# Altium schematic sheet twentyfour.SchDoc
size Letter
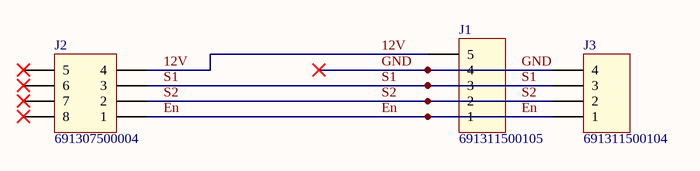
[diagram p0: twentyfour.SchDoc]

## Parts
J1  691311500105  [691311500105]
J2  691307500004  [691307500004]
J3  691311500104  [691311500104]

## Nets
12V: J1.5 J2.4
En: J1.1 J2.1 J3.1
GND: J1.4 J3.4
S1: J1.3 J2.3 J3.3
S2: J1.2 J2.2 J3.2

Not connected (* = marked no-connect by the designer): J2 5* 6* 7* 8*

## Library data of the parts
J1 = 691311500105: WR-TBL Serie 311 - 5.08 mm Close Vertical PCB Header, 05p; Pitch: 5.08 mm; ComponentLink1Description: Manufacturer; ComponentLink1URL: http://www.we-online.de; ComponentLink2Description: Datasheet; ComponentLink2URL: http://katalog.we-online.de/em/datasheet/6913115001xx.pdf; Part Number: 691311500105; Published Date: Feb. 2017; Publisher: Wurth Elektronik; Pin Number: 05p
J2 = 691307500004: WR-TBL Serie 3075 - 5.08 mm Reversed Gender Vertical PCB Header, 04p; Pitch: 5.08 mm; ComponentLink1Description: Manufacturer; ComponentLink1URL: http://www.we-online.de; ComponentLink2Description: Datasheet; ComponentLink2URL: http://katalog.we-online.de/em/datasheet/6913075000xx.pdf; Part Number: 691307500004; Published Date: Feb. 2017; Publisher: Wurth Elektronik; Pin Number: 04p
J3 = 691311500104: WR-TBL Serie 311 - 5.08 mm Close Vertical PCB Header, 04p; Pitch: 5.08 mm; ComponentLink1Description: Manufacturer; ComponentLink1URL: http://www.we-online.de; ComponentLink2Description: Datasheet; ComponentLink2URL: http://katalog.we-online.de/em/datasheet/6913115001xx.pdf; Part Number: 691311500104; Published Date: Feb. 2017; Publisher: Wurth Elektronik; Pin Number: 04p